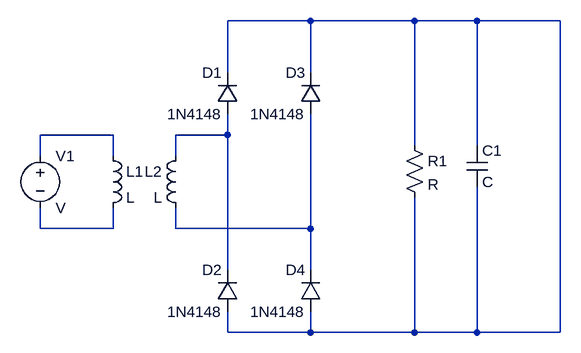
[diagram p0: schematic Rectifier.asc]
Rectifier.asc, the LTspice schematic file:
Version 4
SHEET 1 884 680
WIRE 496 -80 368 -80
WIRE 656 -80 496 -80
WIRE 752 -80 656 -80
WIRE 880 -80 752 -80
WIRE 368 0 368 -80
WIRE 496 0 496 -80
WIRE 192 96 80 96
WIRE 368 96 368 64
WIRE 368 96 288 96
WIRE 656 112 656 -80
WIRE 752 112 752 -80
WIRE 80 128 80 96
WIRE 192 128 192 96
WIRE 288 128 288 96
WIRE 80 240 80 208
WIRE 192 240 192 208
WIRE 192 240 80 240
WIRE 288 240 288 208
WIRE 496 240 496 64
WIRE 496 240 288 240
WIRE 368 304 368 96
WIRE 496 304 496 240
WIRE 368 400 368 368
WIRE 496 400 496 368
WIRE 496 400 368 400
WIRE 656 400 656 192
WIRE 656 400 496 400
WIRE 752 400 752 176
WIRE 752 400 656 400
WIRE 880 400 880 -80
WIRE 880 400 752 400
SYMBOL voltage 80 112 R0
SYMATTR InstName V1
SYMBOL ind 176 112 R0
SYMATTR InstName L1
SYMBOL ind 304 112 M0
SYMATTR InstName L2
SYMBOL diode 384 64 R180
WINDOW 0 24 64 Left 2
WINDOW 3 24 0 Left 2
SYMATTR InstName D1
SYMATTR Value 1N4148
SYMBOL diode 384 368 R180
WINDOW 0 24 64 Left 2
WINDOW 3 24 0 Left 2
SYMATTR InstName D2
SYMATTR Value 1N4148
SYMBOL diode 512 64 R180
WINDOW 0 24 64 Left 2
WINDOW 3 24 0 Left 2
SYMATTR InstName D3
SYMATTR Value 1N4148
SYMBOL diode 512 368 R180
WINDOW 0 24 64 Left 2
WINDOW 3 24 0 Left 2
SYMATTR InstName D4
SYMATTR Value 1N4148
SYMBOL res 640 96 R0
SYMATTR InstName R1
SYMBOL cap 736 112 R0
SYMATTR InstName C1

The netlist it stands for:
* Rectifier.asc
V1 N002 N004 V
L1 N002 N004 L
L2 N003 N005 L
D1 N003 N001 1N4148
D2 N001 N003 1N4148
D3 N005 N001 1N4148
D4 N001 N005 1N4148
R1 N001 N001 R
C1 N001 N001 C
.model D D
.lib standard.dio
.backanno
.end